# EAGLE design nixie_with_colon (EAGLE 9.2.2)
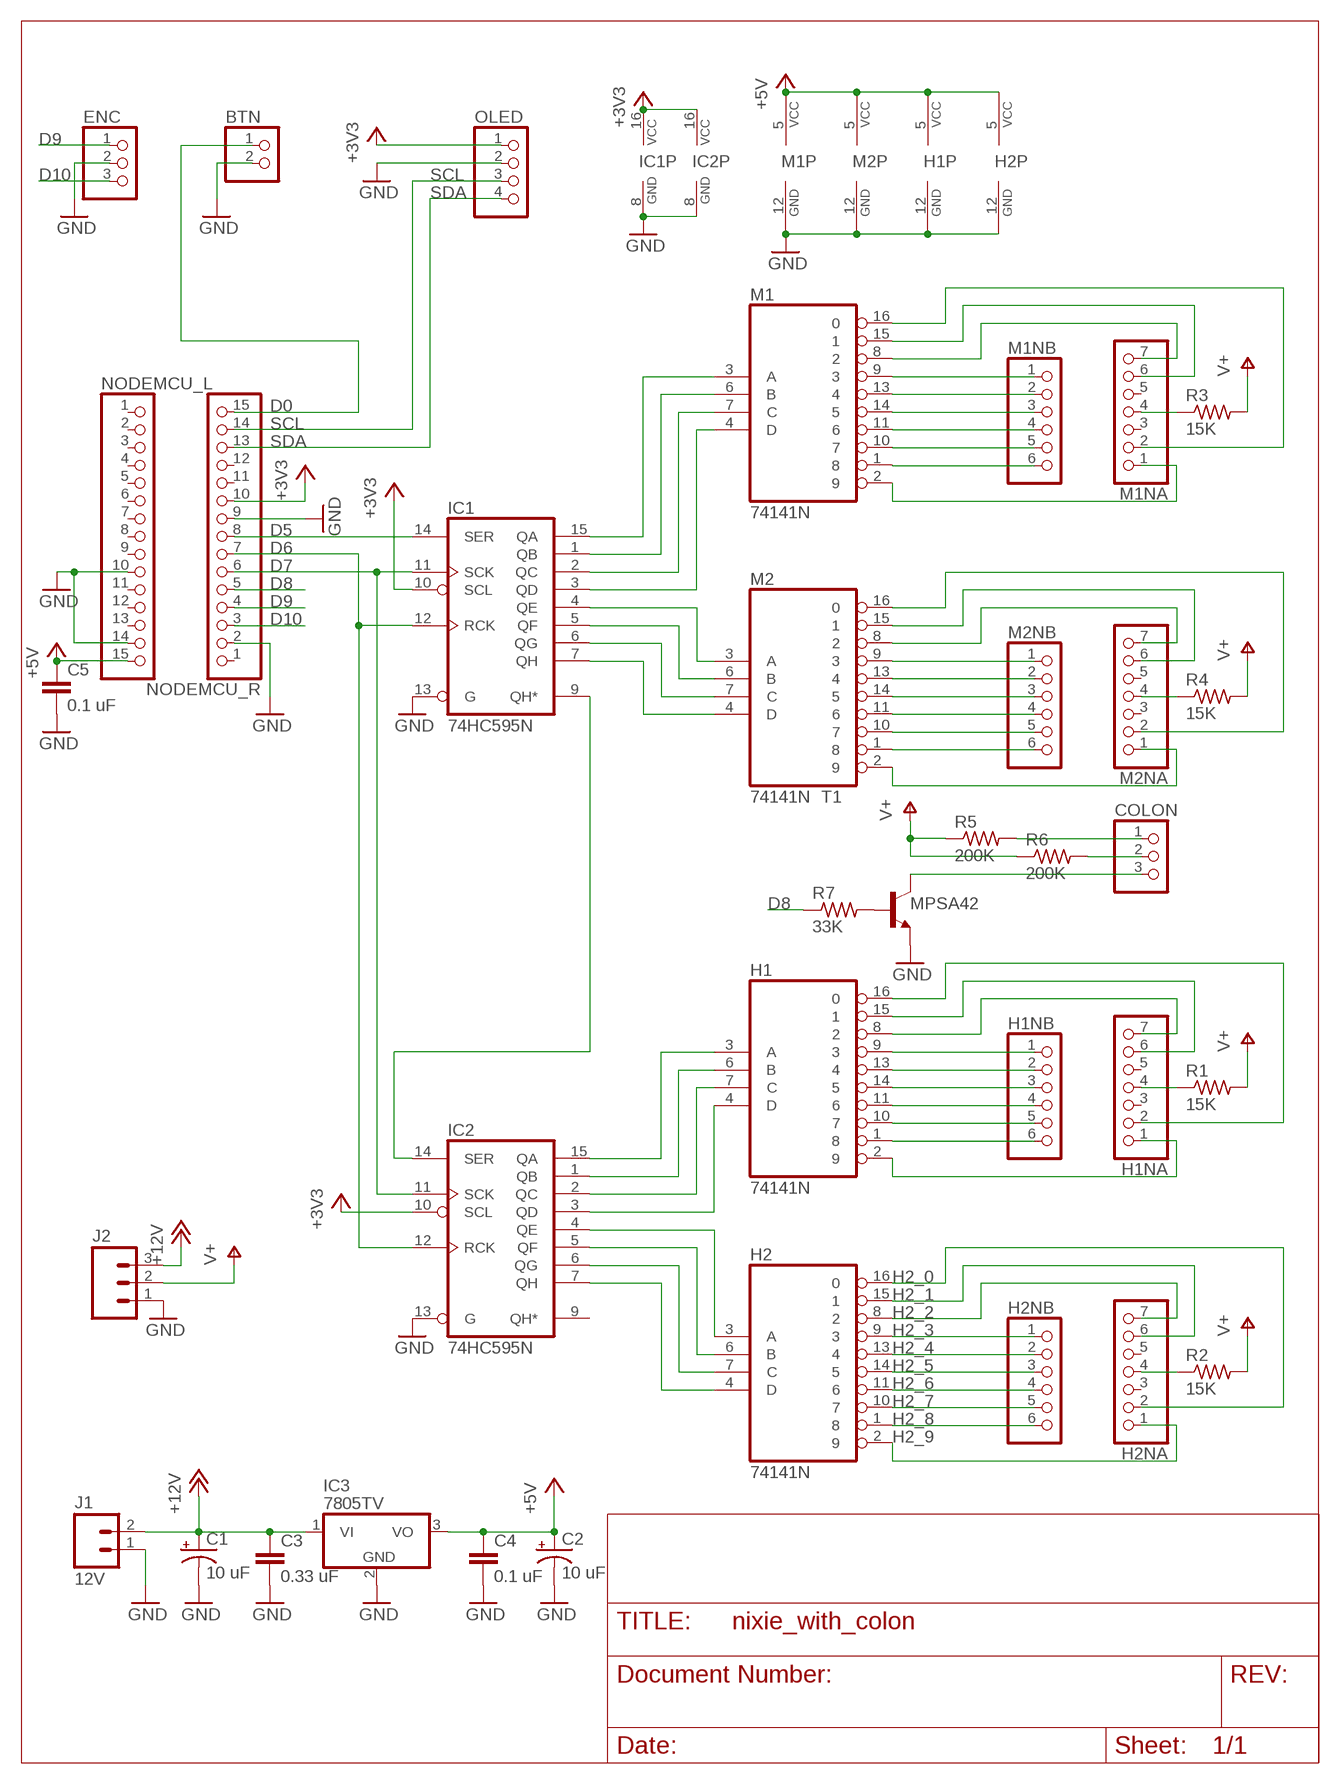
[diagram p0: schematic, sheet 1]

## Parts
BTN  PINHD-1X2  [1X02]
C1  10 uF  CPOL-USE2.5-6  [E2,5-6]
C2  10 uF  CPOL-USE2.5-6  [E2,5-6]
C3  0.33 uF  C-EU050-025X075  [C050-025X075]
C4  0.1 uF  C-EU050-025X075  [C050-025X075]
C5  0.1 uF  C-EU050-025X075  [C050-025X075]
COLON  PINHD-1X3  [1X03]
ENC  PINHD-1X3  [1X03]
H1  74141N  [DIL16]
H1NA  PINHD-1X7  [1X07]
H1NB  PINHD-1X6  [1X06]
H2  74141N  [DIL16]
H2NA  PINHD-1X7  [1X07]
H2NB  PINHD-1X6  [1X06]
IC1  74HC595N  [DIL16]
IC2  74HC595N  [DIL16]
IC3  7805TV  [TO220V]
J1  12V  M025MM  [SCREWTERMINAL-5MM-2]
J2  M03-SCREW-5MM  [SCREWTERMINAL-5MM-3]
M1  74141N  [DIL16]
M1NA  PINHD-1X7  [1X07]
M1NB  PINHD-1X6  [1X06]
M2  74141N  [DIL16]
M2NA  PINHD-1X7  [1X07]
M2NB  PINHD-1X6  [1X06]
NODEMCU_L  PINHD-1X15  [1X15]
NODEMCU_R  PINHD-1X15  [1X15]
OLED  PINHD-1X4  [1X04]
R1  15K  R-US_0207/10  [0207/10]
R2  15K  R-US_0207/10  [0207/10]
R3  15K  R-US_0207/10  [0207/10]
R4  15K  R-US_0207/10  [0207/10]
R5  200K  R-US_0207/10  [0207/10]
R6  200K  R-US_0207/10  [0207/10]
R7  33K  R-US_0207/10  [0207/10]
T1  MPSA42  MPSA42-NPN-TO92-EBC  [TO92-EBC]

## Nets
+3V3: IC1.10(SCL) IC1.16(VCC) IC2.10(SCL) IC2.16(VCC) NODEMCU_R.10 OLED.1
+5V: C2.+ C4.1 C5.1 H1.5(VCC) H2.5(VCC) IC3.3(VO) M1.5(VCC) M2.5(VCC) NODEMCU_L.15
+12V: C1.+ C3.1 IC3.1(VI) J1.2 J2.3
D0: BTN.1 NODEMCU_R.15
D5: IC1.14(SER) NODEMCU_R.8
D6: IC1.12(RCK) IC2.12(RCK) NODEMCU_R.7
D7: IC1.11(SCK) IC2.11(SCK) NODEMCU_R.6
D8: NODEMCU_R.5 R7.1
D9: ENC.1 NODEMCU_R.4
D10: ENC.3 NODEMCU_R.3
GND: BTN.2 C1.- C2.- C3.2 C4.2 C5.2 ENC.2 H1.12(GND) H2.12(GND) IC1.8(GND) IC1.13(G) IC2.8(GND) IC2.13(G) IC3.2(GND) J1.1 J2.1 M1.12(GND) M2.12(GND) NODEMCU_L.10 NODEMCU_L.14 NODEMCU_R.2 NODEMCU_R.9 OLED.2 T1.E
H2_0: H2.16 H2NA.2
H2_1: H2.15 H2NA.6
H2_2: H2.8 H2NA.7
H2_3: H2.9 H2NB.1
H2_4: H2.13 H2NB.2
H2_5: H2.14 H2NB.3
H2_6: H2.11 H2NB.4
H2_7: H2.10 H2NB.5
H2_8: H2.1 H2NB.6
H2_9: H2.2 H2NA.1
N$1: H1.16 H1NA.2
N$2: H1.2 H1NA.1
N$3: H1.9 H1NB.1
N$4: H1.13 H1NB.2
N$5: H1.14 H1NB.3
N$6: H1.11 H1NB.4
N$7: H1.10 H1NB.5
N$8: H1.1 H1NB.6
N$9: H1.8 H1NA.7
N$10: H1.15 H1NA.6
N$11: H1NA.4 R1.1
N$12: COLON.2 R6.2
N$13: COLON.1 R5.2
N$14: COLON.3 T1.C
N$15: R7.2 T1.B
N$22: H2NA.4 R2.1
N$23: M1.16 M1NA.2
N$24: M1.9 M1NB.1
N$25: M1.13 M1NB.2
N$26: M1.14 M1NB.3
N$27: M1.11 M1NB.4
N$28: M1.10 M1NB.5
N$29: M1.1 M1NB.6
N$30: M1.2 M1NA.1
N$31: M1.8 M1NA.7
N$32: M1.15 M1NA.6
N$33: M1NA.4 R3.1
N$34: M2.16 M2NA.2
N$35: M2.9 M2NB.1
N$36: M2.13 M2NB.2
N$37: M2.14 M2NB.3
N$38: M2.11 M2NB.4
N$39: M2.10 M2NB.5
N$40: M2.1 M2NB.6
N$41: M2.2 M2NA.1
N$42: M2.8 M2NA.7
N$43: M2.15 M2NA.6
N$44: M2NA.4 R4.1
N$45: IC1.15(QA) M1.3(A)
N$46: IC1.1(QB) M1.6(B)
N$47: IC1.2(QC) M1.7(C)
N$48: IC1.3(QD) M1.4(D)
N$49: IC1.4(QE) M2.3(A)
N$50: IC1.5(QF) M2.6(B)
N$51: IC1.6(QG) M2.7(C)
N$52: IC1.7(QH) M2.4(D)
N$53: H1.3(A) IC2.15(QA)
N$54: H1.6(B) IC2.1(QB)
N$55: H1.7(C) IC2.2(QC)
N$56: H1.4(D) IC2.3(QD)
N$57: H2.3(A) IC2.4(QE)
N$58: H2.6(B) IC2.5(QF)
N$59: H2.7(C) IC2.6(QG)
N$60: H2.4(D) IC2.7(QH)
N$61: IC1.9(QH*) IC2.14(SER)
SCL: NODEMCU_R.14 OLED.3
SDA: NODEMCU_R.13 OLED.4
V+: J2.2 R1.2 R2.2 R3.2 R4.2 R5.1 R6.1
Unconnected: H1NA.3 H1NA.5 H2NA.3 H2NA.5 IC2.9(QH*) M1NA.3 M1NA.5 M2NA.3 M2NA.5 NODEMCU_L.1 NODEMCU_L.2 NODEMCU_L.3 NODEMCU_L.4 NODEMCU_L.5 NODEMCU_L.6 NODEMCU_L.7 NODEMCU_L.8 NODEMCU_L.9 NODEMCU_L.11 NODEMCU_L.12 NODEMCU_L.13 NODEMCU_R.1 NODEMCU_R.11 NODEMCU_R.12

## Library data of the parts
BTN = pinhead:PINHD-1X2: PIN HEADER
C1 C2 = adafruit:CPOL-US: POLARIZED CAPACITOR, American symbol
C3-C5 = resistor:C-EU: CAPACITOR, European symbol
COLON ENC = pinhead:PINHD-1X3: PIN HEADER
H1 H2 M1 M2 = 74xx-us:74*141: BCD to decimal DECODER/DRIVER
H1NA H2NA M1NA M2NA = pinhead:PINHD-1X7: PIN HEADER
H1NB H2NB M1NB M2NB = pinhead:PINHD-1X6: PIN HEADER
IC1 IC2 = 74xx-eu:74*595: 8-bit SHIFT REGISTER, output latch
IC3 = linear:78*: Positive VOLTAGE REGULATOR Source: http://cache.national.com/ds/LM/LM78L05.pdf http://www.fairchildsemi.com/ds/LM/LM7805.pdf
J1 = SparkFun-Connectors:M02: Standard 2-pin 0.1" header. Use with - straight break away headers ( PRT-00116) - right angle break away headers (PRT-00553) - swiss pins (PRT-00743) - machine pins (PRT-00117) - female headers (PRT-00115) Molex polarized connector foot print use with: PRT-08233 with associated crimp pins and housings. 2.54_SCREWTERM for use with PRT-10571. 3.5mm Screw Terminal footprints for PRT-08084 5mm Screw Terminal footprints for use with PRT-08432; STOREFRONT_ID: PRT-08432
J2 = SparkFun-Connectors:M03: Header 3 Standard 3-pin 0.1" header. Use with straight break away headers (SKU : PRT-00116), right angle break away headers (PRT-00553), swiss pins (PRT-00743), machine pins (PRT-00117), and female headers (PRT-00115). Molex polarized connector foot print use with SKU : PRT-08232 with associated crimp pins and housings.; STOREFRONT_ID: PRT-08433
NODEMCU_L NODEMCU_R = pinhead:PINHD-1X15: PIN HEADER
OLED = pinhead:PINHD-1X4: PIN HEADER
R1-R7 = resistor:R-US_: RESISTOR, American symbol
T1 = transistor:*-NPN-: NPN Transistror BF959 corrected 2008.03.06

## Board
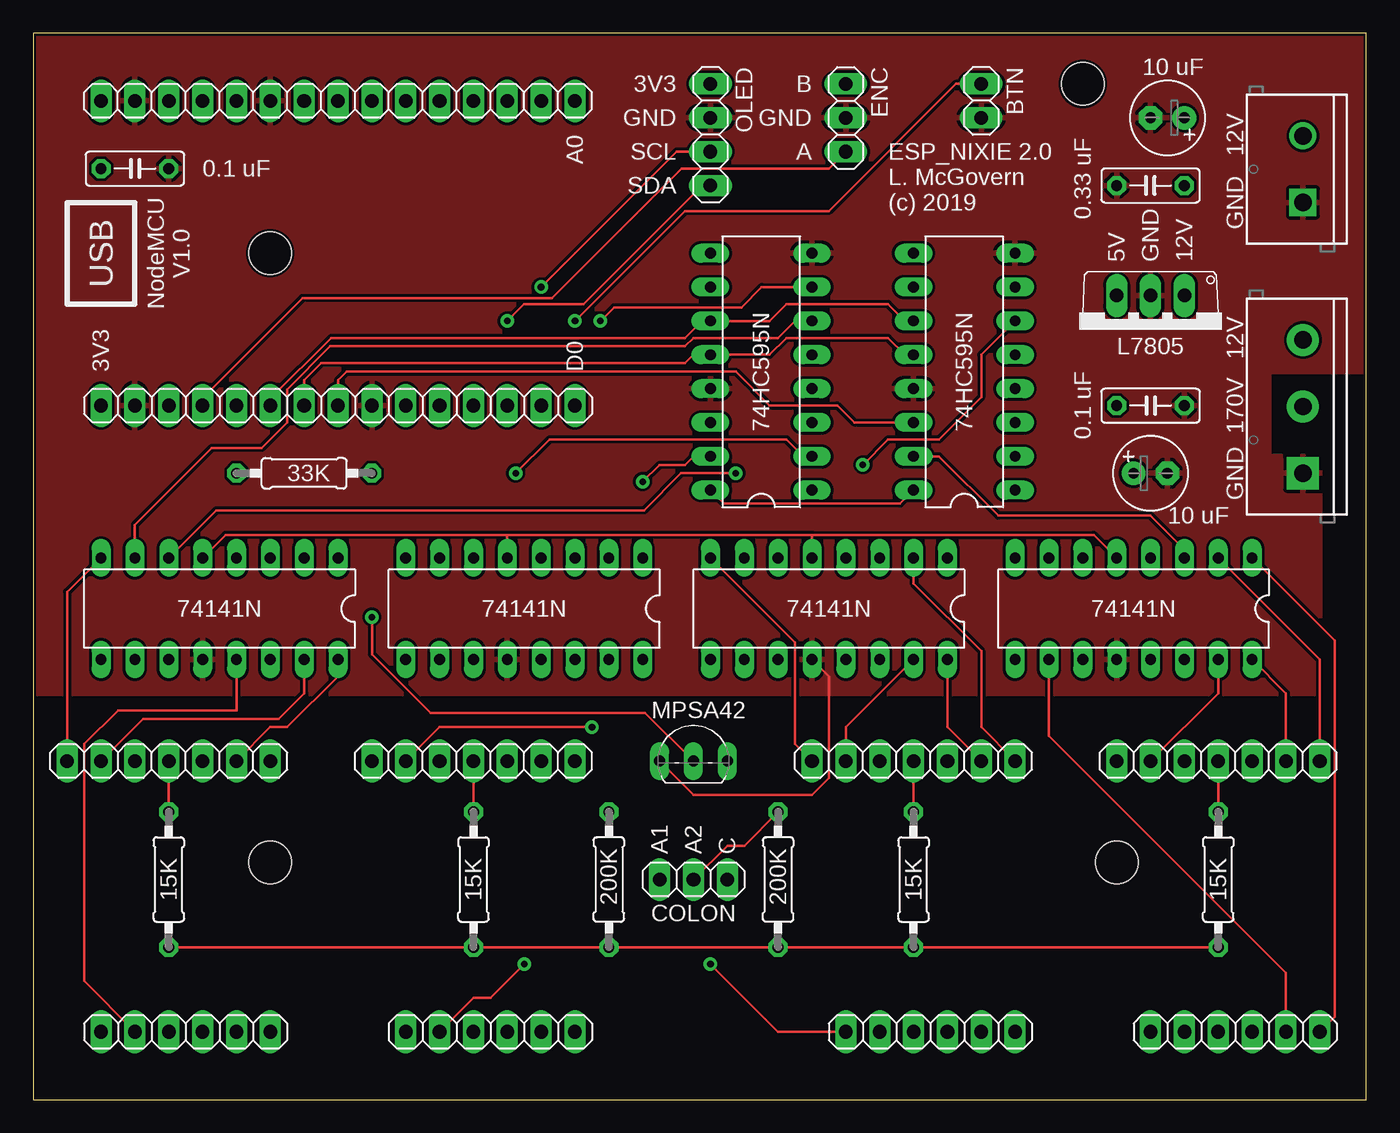
[diagram p1: board, top side]
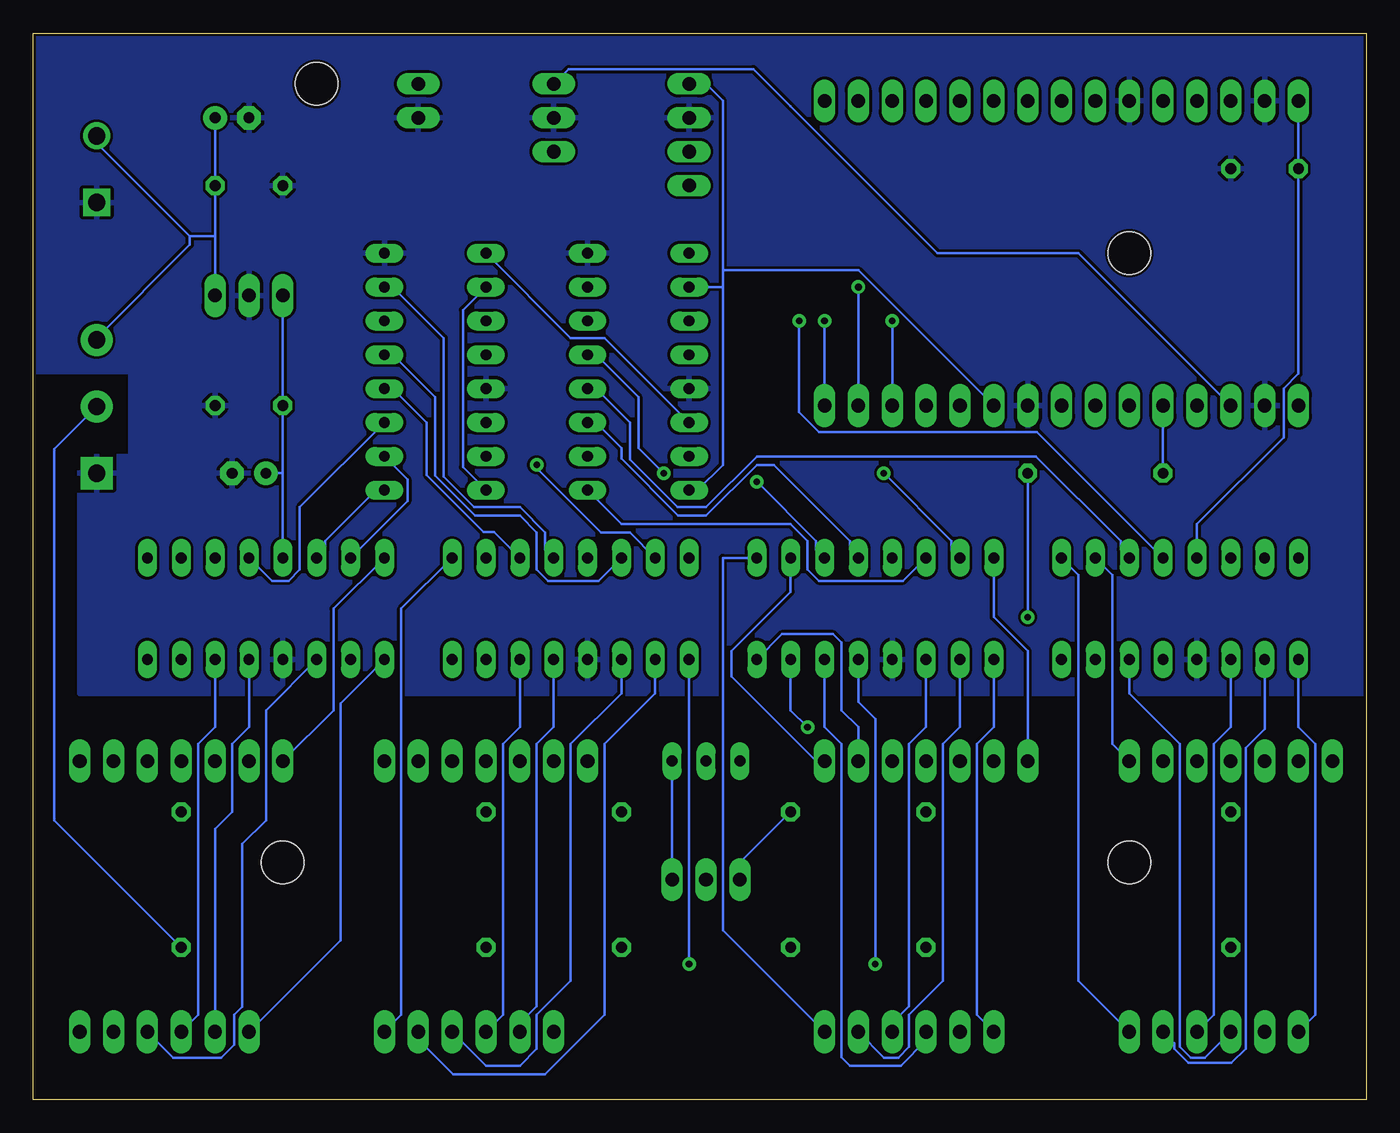
[diagram p2: board, bottom side, seen from below]

Size 100 x 80 mm. Coordinates in mm from the lower left corner, seen from the top.
Outline: 0,0 100,0 100,80 0,80 0,0
Copper layers (1*16): Top 0.035mm / dielectric 1.5mm / Bottom 0.035mm
Design rules "SparkFun": minimum track width 8mil, minimum drill 20mil, track to track 8mil, track to pad 8mil, pad to pad 8mil, via to via 8mil, smd to smd 8mil, copper to edge 8mil, drill to drill 8mil, minimum pad ring 12mil, minimum via ring 10mil, stop-mask expansion 4mil, vias tented up to drill 20mil, thermal gap 10mil
Holes 3.2 mm at 17.78,63.5 78.74,76.2 17.78,17.78 81.28,17.78

### Footprints (pad centres in the part's own frame; a part is rotated, then mirrored left to right if it is on the bottom)
1X02 = drill 1.016 long: 1 -1.27,0; 2 1.27,0
E2,5-6 = drill 0.813 pad 1.778: + -1.27,0 | drill 0.813 pad 1.778 octagon: - 1.27,0
C050-025X075 = drill 0.813 octagon: 1 -2.54,0; 2 2.54,0
1X03 = drill 1.016 long: 1 -2.54,0; 2 0,0; 3 2.54,0
DIL16 = drill 0.813 long: 1 -8.89,-3.81; 2 -6.35,-3.81; 3 -3.81,-3.81; 4 -1.27,-3.81; 5 1.27,-3.81; 6 3.81,-3.81; 7 6.35,-3.81; 8 8.89,-3.81; 9 8.89,3.81; 10 6.35,3.81; 11 3.81,3.81; 12 1.27,3.81; 13 -1.27,3.81; 14 -3.81,3.81; 15 -6.35,3.81; 16 -8.89,3.81
1X07 = drill 1.016 long: 1 -7.62,0; 2 -5.08,0; 3 -2.54,0; 4 0,0; 5 2.54,0; 6 5.08,0; 7 7.62,0
1X06 = drill 1.016 long: 1 -6.35,0; 2 -3.81,0; 3 -1.27,0; 4 1.27,0; 5 3.81,0; 6 6.35,0
TO220V = drill 1.016 long: 1 -2.54,-2.54; 2 0,-2.54; 3 2.54,-2.54
SCREWTERMINAL-5MM-2 = drill 1.3 pad 2.032 square: 1 0,0 | drill 1.3 pad 2.032: 2 5,0
SCREWTERMINAL-5MM-3 = drill 1.3 pad 2.413 square: 1 0,0 | drill 1.3 pad 2.413: 2 5,0; 3 10,0
1X15 = drill 1.016 long: 1 -17.78,0; 2 -15.24,0; 3 -12.7,0; 4 -10.16,0; 5 -7.62,0; 6 -5.08,0; 7 -2.54,0; 8 0,0; 9 2.54,0; 10 5.08,0; 11 7.62,0; 12 10.16,0; 13 12.7,0; 14 15.24,0; 15 17.78,0
1X04 = drill 1.016 long: 1 -3.81,0; 2 -1.27,0; 3 1.27,0; 4 3.81,0
0207/10 = drill 0.813 octagon: 1 -5.08,0; 2 5.08,0
TO92-EBC = drill 0.813 long: B 0,-1.27; C 2.54,-1.27; E -2.54,-1.27

### Placement (x,y rotation side)
BTN  71.12,74.93 270 top
C1  85.09,73.66 180 top
C2  83.82,46.99 0 top
C3  83.82,68.58 180 top
C4  83.82,52.07 0 top
C5  7.62,69.85 0 top
COLON  49.53,16.51 0 top
ENC  60.96,73.66 90 top
H1  36.83,36.83 180 top
H1NA  33.02,25.4 180 top
H1NB  34.29,5.08 0 top
H2  13.97,36.83 180 top
H2NA  10.16,25.4 180 top
H2NB  11.43,5.08 0 top
IC1  69.85,54.61 90 top
IC2  54.61,54.61 90 top
IC3  83.82,57.78 180 top
J1  95.25,67.31 90 top
J2  95.25,46.99 90 top
M1  82.55,36.83 180 top
M1NA  88.9,25.4 180 top
M1NB  90.17,5.08 0 top
M2  59.69,36.83 180 top
M2NA  66.04,25.4 180 top
M2NB  67.31,5.08 0 top
NODEMCU_L  22.86,74.93 180 top
NODEMCU_R  22.86,52.07 0 top
OLED  50.8,72.39 270 top
R1  33.02,16.51 270 top
R2  10.16,16.51 270 top
R3  88.9,16.51 270 top
R4  66.04,16.51 270 top
R5  43.18,16.51 90 top
R6  55.88,16.51 90 top
R7  20.32,46.99 0 top
T1  49.53,26.67 0 top

### Tracks (layer width: path | path; a pad name or v marks a point on that pad's centre or on a via)
+3V3
  Top 0.203: IC1.16 65.02,44.7 51.82,44.7 IC2.16
  Bottom 0.203: 48.26,60.96 IC2.10 | 48.26,60.96 48.26,47.62 50.16,45.72 IC2.16 | NODEMCU_R.10 38.1,62.23 48.26,62.23 | 48.26,60.96 48.26,62.23 | 48.26,62.23 48.26,74.93 49.53,76.2 OLED.1 | IC1.10 67.77,59.23 67.77,47.45 IC1.16
+5V
  Top 0.203: M1.5 79.55,42.37 58.42,42.37 | H2.5 14.43,42.37 35.56,42.37 | 58.42,42.37 35.56,42.37 | H1.5 35.56,42.37 | M2.5 58.42,42.37
  Bottom 0.203: H2.5 12.7,43.18 6.2,49.68 6.2,53.35 5.08,54.46 C5.1 NODEMCU_L.15 | IC3.3 C4.1 81.28,46.99 | 81.28,46.99 M1.5 | C2.+ 81.28,46.99
+12V
  Bottom 0.203: 88.27,64.77 95.25,71.75 J1.2 | J2.3 95.25,57.15 88.27,64.14 88.27,64.77 | 86.36,64.77 C3.1 C1.+ | 86.36,64.77 IC3.1 | 88.27,64.77 86.36,64.77
D0  (via drill 0.51)
  Top 0.203: v40.64,58.42 48.9,66.67 59.69,66.67 69.22,76.2 BTN.1
  Bottom 0.203: v40.64,58.42 NODEMCU_R.15
D5
  Top 0.203: IC1.14 61.59,50.8 60.33,52.07 55.24,52.07 52.7,54.61 23.5,54.61 22.86,53.98 NODEMCU_R.8
D6
  Top 0.203: IC1.12 65.41,55.88 64.14,57.15 56.52,57.15 55.24,55.88 IC2.12 49.53,55.88 48.9,55.24 21.59,55.24 20.32,53.98 NODEMCU_R.7
D7
  Top 0.203: IC1.11 65.41,58.42 64.14,59.69 56.52,59.69 55.24,58.42 IC2.11 50.16,58.42 48.9,57.15 22.34,57.15 17.78,52.59 NODEMCU_R.6
D8
  Bottom 0.203: NODEMCU_R.5 R7.1
D9
  Top 0.203: NODEMCU_R.4 12.7,52.65 20.2,60.15 38.91,60.15 48.62,69.85 54.61,69.85 59.69,69.85 ENC.1
D10
  Bottom 0.203: ENC.3 59.84,77.32 45.97,77.32 43.18,74.52 32.16,63.5 21.59,63.5 NODEMCU_R.3
GND
  Top 0.203: T1.E 49.53,22.86 58.42,22.86 59.69,24.13 59.69,31.75 M2.12
  pour Top: 0,78.74 0,80.01 100.33,80.01 100.33,78.74 100.33,54.61 92.71,54.61 92.71,53.34 92.71,48.26 96.52,48.26 96.52,30.48 0,30.48
  pour Bottom: 0,30.48 0,80.01 100.33,80.01 100.33,78.74 100.33,54.61 92.71,54.61 92.71,48.26 96.52,48.26 96.52,30.48
H2_0
  Top 0.203: H2NA.2 17.78,27.94 19.05,27.94 22.86,31.75 H2.16
H2_1
  Top 0.203: H2.15 20.32,30.48 18.41,28.57 8.26,28.57 H2NA.6
H2_2
  Top 0.203: H2.8 2.54,38.1 H2NA.7
H2_3
  Bottom 0.203: H2.9 5.08,27.94 3.81,26.67 3.81,6.35 H2NB.1
H2_4
  Top 0.203: H2.13 15.24,29.21 6.35,29.21 3.81,26.67 3.81,8.89 H2NB.2
H2_5
  Bottom 0.203: H2.14 17.78,30.48 13.97,26.67 13.97,3.96 13.16,3.15 12.09,3.15 H2NB.3
H2_6
  Bottom 0.203: H2.11 10.16,27.94 11.43,26.67 11.43,6.35 H2NB.4
H2_7
  Bottom 0.203: H2.10 7.62,27.79 9.04,26.37 9.04,3.8 10.1,2.74 13.33,2.74 14.38,3.79 14.38,4.22 H2NB.5
H2_8
  Bottom 0.203: H2.1 21.59,39.37 21.59,24.13 21.59,8.89 H2NB.6
H2_9
  Bottom 0.203: H2.2 19.05,39.37 19.05,26.67 H2NA.1
N$1
  Bottom 0.203: H1NA.2 38.1,27.94 39.37,29.21 39.37,34.29 40.01,34.92 43.81,34.92 H1.16
N$2
  Bottom 0.203: H1.2 43.18,38.1 47.62,33.66 47.62,31.75 41.27,25.4 H1NA.1
N$3
  Bottom 0.203: H1.9 27.94,27.94 29.21,26.67 29.21,6.35 H1NB.1
N$4  (via drill 0.51)
  Top 0.203: v36.83,10.16 34.29,7.62 33.02,7.62 H1NB.2
  Bottom 0.203: H1.13 38.1,29.84 36.83,28.57 v36.83,10.16
N$5
  Bottom 0.203: H1.14 40.64,27.94 39.37,26.67 39.37,3.17 38.73,2.54 34.92,2.54 33.02,4.45 H1NB.3
N$6
  Bottom 0.203: H1.11 33.02,27.94 34.29,26.67 34.29,6.99 35.56,5.71 H1NB.4
N$7
  Bottom 0.203: H1.10 30.48,27.94 31.75,26.67 31.75,8.89 34.29,6.35 34.29,3.96 35.1,3.15 36.17,3.15 H1NB.5
N$8
  Bottom 0.203: H1.1 48.26,40.64 48.26,12.7 H1NB.6
N$9
  Bottom 0.203: H1.8 27.94,36.2 25.4,33.66 H1NA.7
N$10  (via drill 0.51)
  Top 0.203: v41.91,27.94 30.48,27.94 H1NA.6
  Bottom 0.203: H1.15 43.18,29.21 v41.91,27.94
N$11
  Top 0.203: H1NA.4 R1.1
N$12
  Top 0.203: R6.2 53.34,19.05 52.07,19.05 COLON.2
N$13
  Bottom 0.203: R5.2 46.99,17.78 COLON.1
N$14
  Bottom 0.203: COLON.3 T1.C
N$15  (via drill 0.51)
  Top 0.203: T1.B 45.91,29.02 29.79,29.02 25.4,33.41 v25.4,36.2
  Bottom 0.203: v25.4,36.2 R7.2
N$22
  Top 0.203: H2NA.4 R2.1
N$23
  Top 0.203: M1.16 93.98,30.48 M1NA.2
N$24
  Bottom 0.203: M1.9 76.96,29.72 76.96,11.94 M1NB.1
N$25
  Bottom 0.203: M1.13 83.82,27.94 85.09,26.67 85.09,21.59 86.36,20.32 M1NB.2
N$26
  Bottom 0.203: M1.14 86.36,27.94 87.63,26.67 87.63,6.35 M1NB.3
N$27
  Bottom 0.203: M1.11 82.55,29.21 82.55,20.95 84.32,19.18 84.32,17.81 84.32,17.78 84.32,6.97 84.94,6.36 84.94,4.11 85.9,3.15 89.51,3.15 M1NB.4
N$28
  Top 0.203: M1.10 76.2,27.29 93.98,9.51 M1NB.5
N$29
  Top 0.203: M1.1 97.64,34.44 97.64,6.2 M1NB.6
N$30
  Top 0.203: M1.2 96.52,33.02 M1NA.1
N$31
  Bottom 0.203: M1.8 77.47,36.83 77.47,29.21 M1NA.7
N$32
  Top 0.203: M1NA.6 88.9,30.48 M1.15
N$33
  Top 0.203: M1NA.4 R3.1
N$34
  Top 0.203: M2.16 68.58,27.94 M2NA.2
N$35  (via drill 0.51)
  Top 0.203: v50.8,10.16 55.88,5.08 M2NB.1
  Bottom 0.203: v50.8,10.16 M2.9
N$36
  Bottom 0.203: M2.13 60.96,27.94 62.23,26.67 62.23,6.99 63.5,5.71 M2NB.2
N$37
  Bottom 0.203: M2.14 63.5,27.94 64.77,26.67 64.77,6.35 M2NB.3
N$38
  Bottom 0.203: M2.11 55.88,30.48 59.69,26.67 59.69,8.89 62.23,6.35 62.23,3.81 63.5,2.54 66.04,2.54 M2NB.4
N$39
  Bottom 0.203: M2.10 53.34,30.48 57.15,26.67 57.15,6.35 61.59,1.91 68.52,1.91 71.12,4.5 M2NB.5
N$40
  Bottom 0.203: M2NB.6 72.39,6.35 72.39,36.83 M2.1
N$41
  Top 0.203: M2NA.1 71.12,27.94 71.12,33.66 66.04,38.73 M2.2
N$42
  Top 0.203: M2.8 57.15,34.29 57.15,26.67 M2NA.7
N$43
  Top 0.203: M2.15 60.96,27.94 M2NA.6
N$44
  Top 0.203: M2NA.4 R4.1
N$45
  Top 0.203: IC1.15 67.94,48.26 72.39,43.81 83.82,43.81 86.36,41.27 M1.3
N$46
  Bottom 0.203: M1.6 78.11,41.27 78.11,41.91 74.3,45.72 IC1.1
N$47
  Bottom 0.203: IC1.2 71.93,46.53 71.93,44.91 M1.7
N$48
  Bottom 0.203: IC1.3 80.01,44.45 80.01,39.76 80.86,38.91 82.09,38.91 M1.4
N$49
  Bottom 0.203: IC1.4 73.03,53.34 70.48,50.8 70.48,46.87 66.2,42.58 65.44,42.58 M2.3
N$50
  Bottom 0.203: IC1.5 73.03,55.88 69.85,52.7 69.85,46.81 66.86,43.81 63.5,43.81 62.23,42.55 62.23,39.76 61.38,38.91 57.61,38.91 M2.6
N$51  (via drill 0.51)
  Top 0.203: v62.23,47.62 64.14,49.53 67.94,49.53 71.12,52.7 71.12,55.88 IC1.6
  Bottom 0.203: M2.7 55.24,42.55 57.39,42.55 62.23,47.38 v62.23,47.62
N$52
  Bottom 0.203: M2.4 61.59,41.27 61.59,42.55 63.5,44.45 66.92,44.45 69.22,46.75 69.22,57.15 73.03,60.96 IC1.7
N$53  (via drill 0.51)
  Top 0.203: v45.72,46.35 46.99,47.62 48.9,47.62 49.53,48.26 IC2.15
  Bottom 0.203: H1.3 41.27,41.27 41.27,41.91 v45.72,46.35
N$54
  Bottom 0.203: IC2.1 55.88,43.18 43.18,43.18 41.91,41.91 41.91,39.76 41.06,38.91 34.75,38.91 H1.6
N$55  (via drill 0.51)
  Top 0.203: v36.2,46.99 38.73,49.53 56.52,49.53 57.78,48.26 IC2.2
  Bottom 0.203: H1.7 31.11,41.27 31.11,41.91 v36.2,46.99
N$56
  Bottom 0.203: H1.4 38.73,41.27 38.73,41.91 44.45,47.62 45.72,47.62 49.53,43.81 51.62,43.81 55.88,48.08 55.88,48.9 57.78,50.8 IC2.3
N$57
  Bottom 0.203: H2.3 18.41,41.27 18.41,41.91 24.77,48.26 45.72,48.26 49.53,44.45 51.68,44.45 55.24,48.02 55.24,50.8 57.78,53.34 IC2.4
N$58  (via drill 0.51)
  Top 0.203: v52.7,46.99 48.6,46.99 45.82,44.21 13.73,44.21 H2.6
  Bottom 0.203: v52.7,46.99 54.61,48.9 54.61,52.7 57.78,55.88 IC2.5
N$59
  Top 0.203: IC2.6 57.15,58.42 55.88,57.15 49.53,57.15 48.9,56.52 22.29,56.52 19.05,53.28 19.05,50.8 17.14,48.9 13.39,48.9 7.62,43.12 H2.7
N$60  (via drill 0.51)
  Top 0.203: v42.55,58.42 43.56,59.44 53.12,59.44 54.65,60.96 IC2.7
  Bottom 0.203: v42.55,58.42 42.55,51.58 41.05,50.09 24.69,50.09 H2.4
N$61
  Bottom 0.203: IC2.14 57.15,57.15 59.69,57.15 IC1.9
SCL  (via drill 0.51)
  Top 0.203: v38.1,60.96 48.26,71.12 OLED.3
  Bottom 0.203: v38.1,60.96 NODEMCU_R.14
SDA  (via drill 0.51)
  Top 0.203: v35.56,58.42 36.83,59.69 41.27,59.69 50.16,68.58 OLED.4
  Bottom 0.203: v35.56,58.42 NODEMCU_R.13
V+
  Top 0.203: R2.2 R1.2 R5.1 R6.1 R4.2 R3.2
  Bottom 0.203: R3.2 98.42,20.95 98.42,48.81 J2.2

### Text on the board
tPlace: OLED | ENC | BTN | 10 uF | 3V3 | B | GND | GND | A0 | 12V | SCL | A | 0.1 uF | ESP_NIXIE 2.0 | SDA | L. McGovern / (c) 2019 | GND | 0.33 uF | USB | NodeMCU / V1.0 | 5V | GND | 12V | L7805 | 12V | 3V3 | D0 | 74HC595N | 74HC595N | 170V | 0.1 uF | GND | 33K | 10 uF | 74141N | 74141N | 74141N | 74141N | MPSA42 | A1 | A2 | C | 15K | 15K | 15K | 15K | 200K | 200K | COLON